# Altium schematic sheet Sheet_QH.SchDoc
size 381 x 241 mm; SheetNumber: 1; SheetTotal: 1
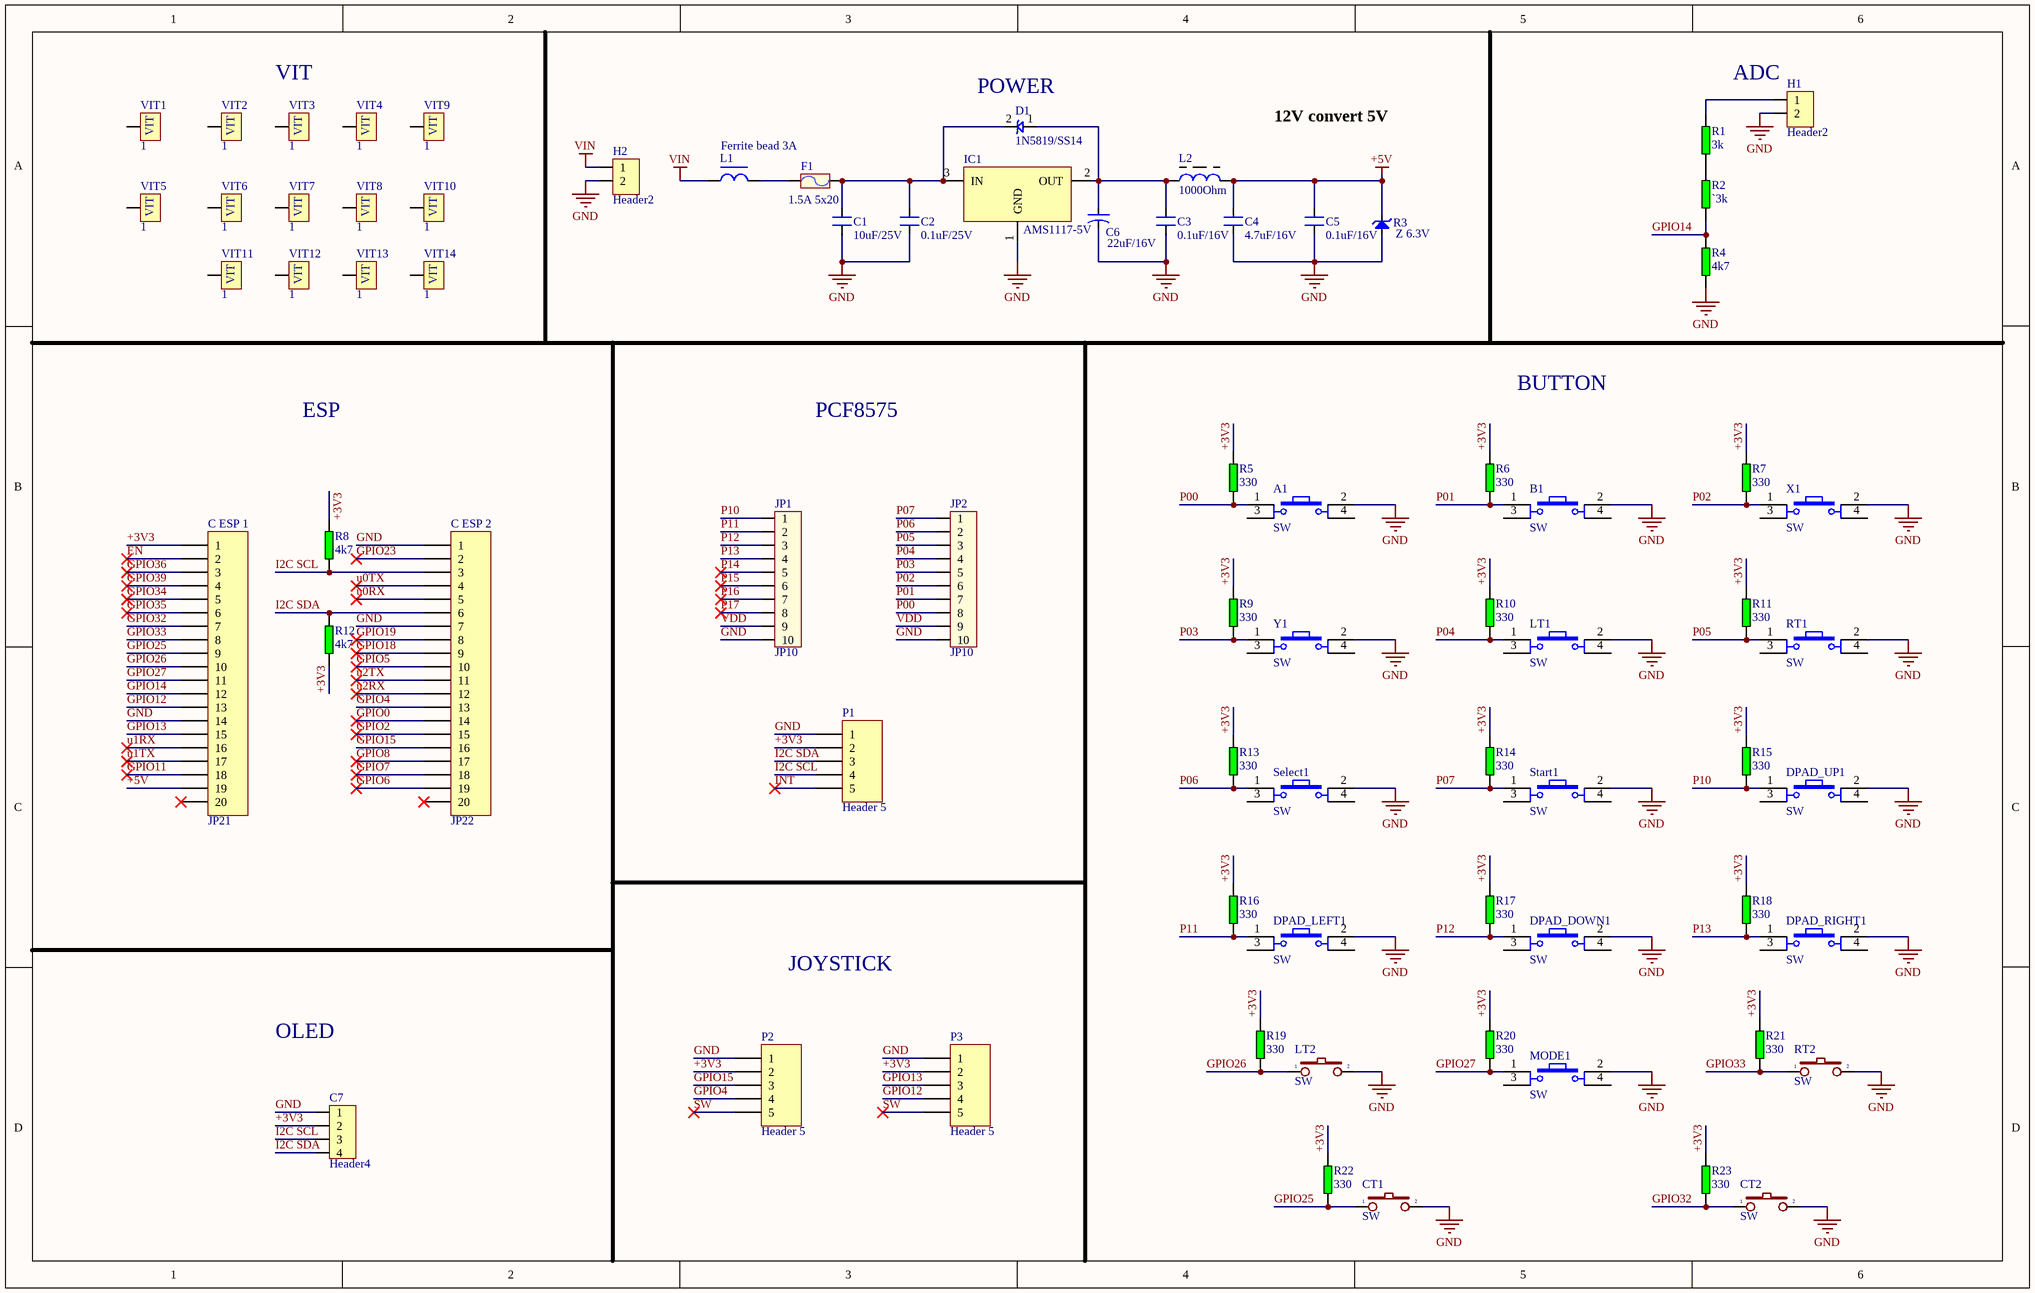
[diagram p0: Sheet_QH.SchDoc]

## Parts
A1  SW  [SW4 - SMD]
B1  SW  [SW4 - SMD]
C1  10uF/25V  [CN-SMD-0805]
C2  0.1uF/25V  [CN-SMD-0805]
C3  0.1uF/16V  [CN-SMD-0805]
C4  4.7uF/16V  [CN-SMD-0805]
C5  0.1uF/16V  [CN-SMD-0805]
C6  22uF/16V  [CAP-ALU-SMD-5.5x5.5]
C7  Header4  [JP4-C1T]
C_ESP_1  JP21  [JP20-C1T]
C_ESP_2  JP22  [JP20-C1T]
CT1  SW  [SW-SMD]
CT2  SW  [SW-SMD]
D1  1N5819/SS14  [SMA]
DPAD_DOWN1  SW  [SW4 - SMD]
DPAD_LEFT1  SW  [SW4 - SMD]
DPAD_RIGHT1  SW  [SW4 - SMD]
DPAD_UP1  SW  [SW4 - SMD]
F1  1.5A 5x20  [RES-SMD-1812]
H1  Header2  [Header2]
H2  Header2  [KF2-3.5]
IC1  AMS1117-5V  [SOT223-4N]
JP1  JP10  [JP10-C1T]
JP2  JP10  [JP10-C1T]
L1  Ferrite bead 3A  [L-DIP-M-6.0]
L2  1000Ohm  [L-DIP-M-6.0]
LT1  SW  [SW4 - SMD]
LT2  SW  [SW-SMD]
MODE1  SW  [SW4 - SMD]
P1  Header 5  [JP5-C1T]
P2  Header 5  [JP5-C1T]
P3  Header 5  [JP5-C1T]
R1  3k  [SM-0805]
R2  `3k  [SM-0805]
R3  Z 6.3V  [1N4148_SMD]
R4  4k7  [SM-0805]
R5  330  [SM-0805]
R6  330  [SM-0805]
R7  330  [SM-0805]
R8  4k7  [SM-0805]
R9  330  [SM-0805]
R10  330  [SM-0805]
R11  330  [SM-0805]
R12  4k7  [SM-0805]
R13  330  [SM-0805]
R14  330  [SM-0805]
R15  330  [SM-0805]
R16  330  [SM-0805]
R17  330  [SM-0805]
R18  330  [SM-0805]
R19  330  [SM-0805]
R20  330  [SM-0805]
R21  330  [SM-0805]
R22  330  [SM-0805]
R23  330  [SM-0805]
RT1  SW  [SW4 - SMD]
RT2  SW  [SW-SMD]
Select1  SW  [SW4 - SMD]
Start1  SW  [SW4 - SMD]
VIT1  1  [VIT]
VIT2  1  [VIT]
VIT3  1  [VIT]
VIT4  1  [VIT]
VIT5  1  [VIT]
VIT6  1  [VIT]
VIT7  1  [VIT]
VIT8  1  [VIT]
VIT9  1  [VIT]
VIT10  1  [VIT]
VIT11  1  [VIT]
VIT12  1  [VIT]
VIT13  1  [VIT]
VIT14  1  [VIT]
X1  SW  [SW4 - SMD]
Y1  SW  [SW4 - SMD]

## Nets
+5V: C4.2 C5.2 C_ESP_1.19 L2.2 R3.2(K)
GND: A1.2 B1.2 C1.1 C2.1 C3.1 C4.1 C5.1 C6.2 C7.1 C_ESP_1.14 C_ESP_2.1 C_ESP_2.7 CT1.2 CT2.2 DPAD_DOWN1.2 DPAD_LEFT1.2 DPAD_RIGHT1.2 DPAD_UP1.2 H1.2 H2.2 IC1.1(GND) JP1.10 JP2.10 LT1.2 LT2.2 MODE1.2 P1.1 P2.1 P3.1 R3.1(A) R4.1 RT1.2 RT2.2 Select1.2 Start1.2 X1.2 Y1.2
VIN: H2.1 L1.1
+3V3: C7.2 C_ESP_1.1 P1.2 P2.2 P3.2 R5.2 R6.2 R7.2 R8.2 R9.2 R10.2 R11.2 R12.1 R13.2 R14.2 R15.2 R16.2 R17.2 R18.2 R19.2 R20.2 R21.2 R22.2 R23.2
EN: C_ESP_1.2
GPIO0: C_ESP_2.14
GPIO2: C_ESP_2.15
GPIO4: C_ESP_2.13 P2.4
GPIO5: C_ESP_2.10
GPIO6: C_ESP_2.19
GPIO7: C_ESP_2.18
GPIO8: C_ESP_2.17
GPIO11: C_ESP_1.18
GPIO12: C_ESP_1.13 P3.4
GPIO13: C_ESP_1.15 P3.3
GPIO14: C_ESP_1.12 R2.1 R4.2
GPIO15: C_ESP_2.16 P2.3
GPIO18: C_ESP_2.9
GPIO19: C_ESP_2.8
GPIO23: C_ESP_2.2
GPIO25: C_ESP_1.9 CT1.1 R22.1
GPIO26: C_ESP_1.10 LT2.1 R19.1
GPIO27: C_ESP_1.11 MODE1.1 R20.1
GPIO32: C_ESP_1.7 CT2.1 R23.1
GPIO33: C_ESP_1.8 R21.1 RT2.1
GPIO34: C_ESP_1.5
GPIO35: C_ESP_1.6
GPIO36: C_ESP_1.3
GPIO39: C_ESP_1.4
I2C SCL: C7.3 C_ESP_2.3 P1.4 R8.1
I2C SDA: C7.4 C_ESP_2.6 P1.3 R12.2
INT: P1.5
P00: A1.1 JP2.8 R5.1
P01: B1.1 JP2.7 R6.1
P02: JP2.6 R7.1 X1.1
P03: JP2.5 R9.1 Y1.1
P04: JP2.4 LT1.1 R10.1
P05: JP2.3 R11.1 RT1.1
P06: JP2.2 R13.1 Select1.1
P07: JP2.1 R14.1 Start1.1
P10: DPAD_UP1.1 JP1.1 R15.1
P11: DPAD_LEFT1.1 JP1.2 R16.1
P12: DPAD_DOWN1.1 JP1.3 R17.1
P13: DPAD_RIGHT1.1 JP1.4 R18.1
P14: JP1.5
P15: JP1.6
P16: JP1.7
P17: JP1.8
SW: P2.5 P3.5
u0RX: C_ESP_2.5
u0TX: C_ESP_2.4
u1RX: C_ESP_1.16
u1TX: C_ESP_1.17
u2RX: C_ESP_2.12
u2TX: C_ESP_2.11
VDD: JP1.9 JP2.9
NetC1_2: C1.2 C2.2 D1.2 F1.2 IC1.3(IN)
NetC3_2: C3.2 C6.1 D1.1 IC1.2(OUT) L2.1
NetF1_1: F1.1 L1.2
NetH1_1: H1.1 R1.2
NetR1_1: R1.1 R2.2

Not connected (* = marked no-connect by the designer): A1 3 4; B1 3 4; C_ESP_1 20*; C_ESP_2 20*; DPAD_DOWN1 3 4; DPAD_LEFT1 3 4; DPAD_RIGHT1 3 4; DPAD_UP1 3 4; LT1 3 4; MODE1 3 4; RT1 3 4; Select1 3 4; Start1 3 4; VIT1 VIT1(1); VIT2 VIT1(1); VIT3 VIT1(1); VIT4 VIT1(1); VIT5 VIT1(1); VIT6 VIT1(1); VIT7 VIT1(1); VIT8 VIT1(1); VIT9 VIT1(1); VIT10 VIT1(1); VIT11 VIT1(1); VIT12 VIT1(1); VIT13 VIT1(1); VIT14 VIT1(1); X1 3 4; Y1 3 4

## Notes on the sheet
- VIT
- (near D1) POWER
- (near H1) ADC
- 12V convert 5V
- ESP
- PCF8575
- BUTTON
- JOYSTICK
- OLED

## Library data of the parts
A1 B1 DPAD_DOWN1 DPAD_LEFT1 DPAD_RIGHT1 DPAD_UP1 LT1 MODE1 RT1 Select1 Start1 X1 Y1 = SW4: Switch button 4 pin; Value: Button chip 4 pin
C1-C5 = CN: Value: 33pF
C6 = CN-ALU-SMD: Polarized Capacitor (Axial); Published: 8-Jun-2000; LatestRevisionDate: 17-Jul-2002; LatestRevisionNote: Re-released for DXP Platform.; PackageReference: POLAR0.8; Publisher: Altium Limited
C7 = Header4: Header IDC, 4 x 1 Pin Vertical 2.54mm Pitch (Non-Boxed, Male); Manufacturer: W¨¹rth Elektronik eiSos GmbH; partNo: 613002143121; ComponentLink1 Description: Manufacturer; ComponentLink2 Description: Datasheet; NoPins: 02; Created Date: 29 March 2013; ComponentLink1URL: http://www.we-online.com; ComponentLink2URL: http://katalog.we-online.de/em/datasheet/6130xx143121.pdf; Created by: Karrer Zheng
C_ESP_1 C_ESP_2 = JP20: WR-PHD 2.54 mm Angled Socket Header; Manufacturer: W¨¹rth Elektronik eiSos GmbH; partNo: 613020143121; ComponentLink1 Description: Manufacturer; ComponentLink2 Description: Datasheet; NoPins: 20; Created Date: 29 March 2013; ComponentLink1URL: http://www.we-online.com; ComponentLink2URL: http://katalog.we-online.de/em/datasheet/6130xx143121.pdf; Created by: Karrer Zheng
CT1 CT2 LT2 RT2 = SW2: Switch button 2 pin; Value: SW chip 2 pin
D1 = Diode Zener SMD
F1 = Fuse: Designed by: VanDungEvn; Value: Fuse
H1 H2 = Header2: Header IDC, 2 x 1 Pin Vertical 2.54mm Pitch (Non-Boxed, Male); Manufacturer: W¨¹rth Elektronik eiSos GmbH; partNo: 613002143121; ComponentLink1 Description: Manufacturer; ComponentLink2 Description: Datasheet; NoPins: 02; Created Date: 29 March 2013; ComponentLink1URL: http://www.we-online.com; ComponentLink2URL: http://katalog.we-online.de/em/datasheet/6130xx143121.pdf; Created by: Karrer Zheng
IC1 = LM1117: 800mA Low-Dropout Linear Regulator; Creator: Nguyen Ba Bien; Website: http://group3i.net
JP1 JP2 = Header10: Connector 10; Value: Connector 10
L1 = L-DIP-1: Inductor; Value: 150 mH
L2 = Inductor Ferit: Inductor; Value: 150 mH
P1-P3 = Header 5: Header, 5-Pin; LatestRevisionDate: 17-Jul-2002; LatestRevisionNote: Re-released for DXP Platform.; Publisher: Altium Limited
R1 R2 R4-R23 = RES: Resistor 1/4W; Value: R1/4W - 1K
R3 = DIODE Zener: Zenner 4.8V
VIT1-VIT14 = VIT: Oc Vit